# EAGLE schematic leer (EAGLE 6.5.0)
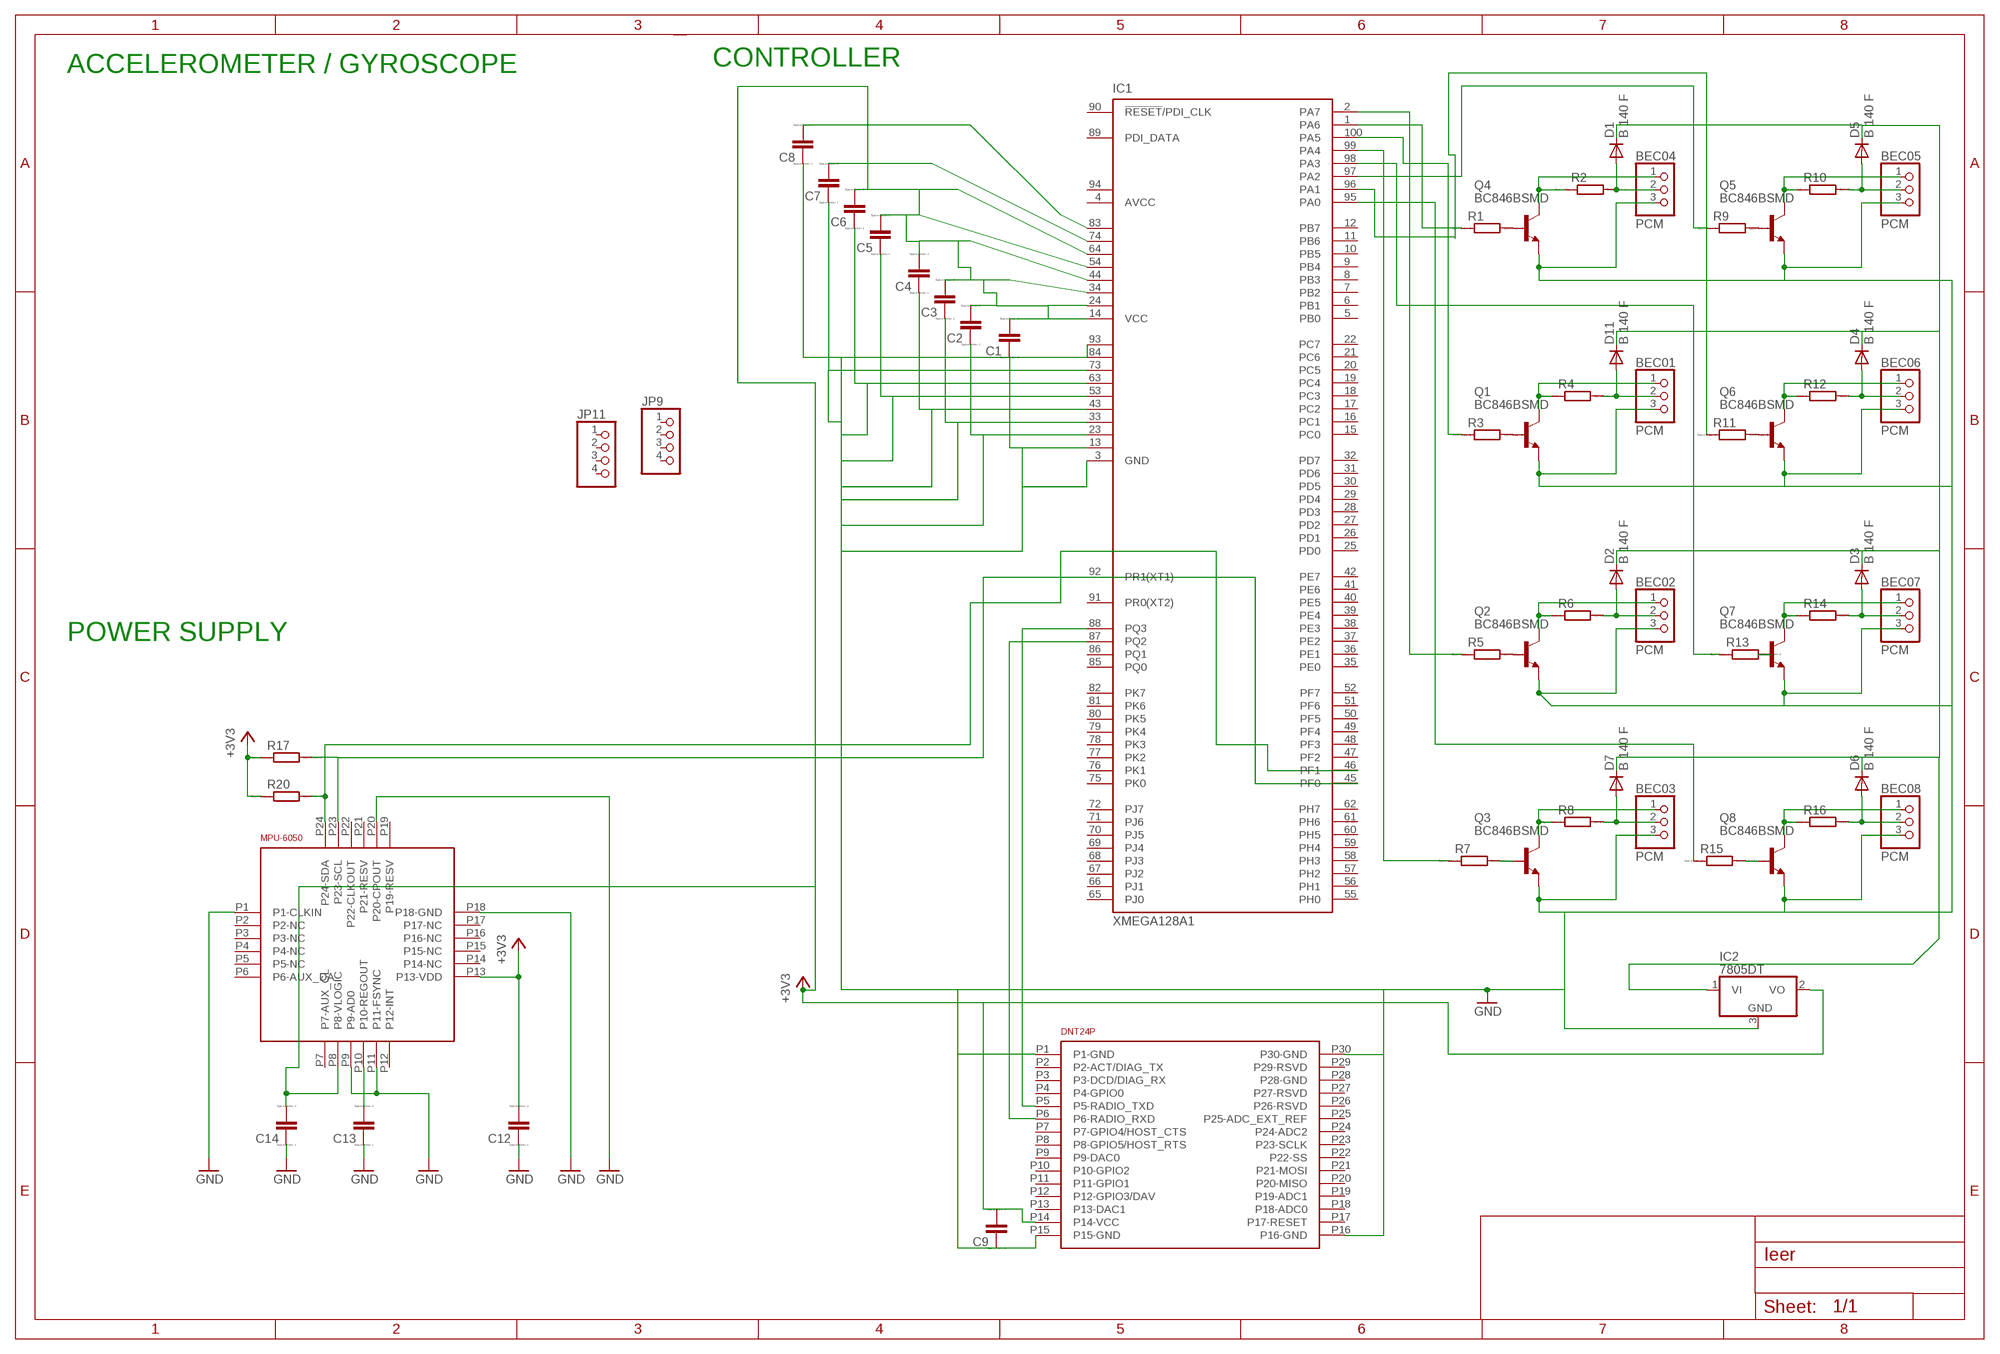
[diagram p0: schematic, sheet 1]

## Parts
BEC01  PCM  PINHD-1X3  [1X03]
BEC02  PCM  PINHD-1X3  [1X03]
BEC03  PCM  PINHD-1X3  [1X03]
BEC04  PCM  PINHD-1X3  [1X03]
BEC05  PCM  PINHD-1X3  [1X03]
BEC06  PCM  PINHD-1X3  [1X03]
BEC07  PCM  PINHD-1X3  [1X03]
BEC08  PCM  PINHD-1X3  [1X03]
C1  CC0603  [C0603]
C2  CC0603  [C0603]
C3  CC0603  [C0603]
C4  CC0603  [C0603]
C5  CC0603  [C0603]
C6  CC0603  [C0603]
C7  CC0603  [C0603]
C8  CC0603  [C0603]
C9  CC0603  [C0603]
C12  CC0603  [C0603]
C13  CC0603  [C0603]
C14  CC0603  [C0603]
D1  B 140 F  CGRM4001-G  [SOD-123_MINI-SMA]
D2  B 140 F  CGRM4001-G  [SOD-123_MINI-SMA]
D3  B 140 F  CGRM4001-G  [SOD-123_MINI-SMA]
D4  B 140 F  CGRM4001-G  [SOD-123_MINI-SMA]
D5  B 140 F  CGRM4001-G  [SOD-123_MINI-SMA]
D6  B 140 F  CGRM4001-G  [SOD-123_MINI-SMA]
D7  B 140 F  CGRM4001-G  [SOD-123_MINI-SMA]
D11  B 140 F  CGRM4001-G  [SOD-123_MINI-SMA]
IC1  XMEGA128A1  [TQFP100]
IC2  7805DT  [TO252]
JP9  PINHD-1X4  [1X04]
JP11  PINHD-1X4  [1X04]
Q1  BC846BSMD  [SOT23]
Q2  BC846BSMD  [SOT23]
Q3  BC846BSMD  [SOT23]
Q4  BC846BSMD  [SOT23]
Q5  BC846BSMD  [SOT23]
Q6  BC846BSMD  [SOT23]
Q7  BC846BSMD  [SOT23]
Q8  BC846BSMD  [SOT23]
R1  RR0603  [R0603]
R2  RR0603  [R0603]
R3  RR0603  [R0603]
R4  RR0603  [R0603]
R5  RR0603  [R0603]
R6  RR0603  [R0603]
R7  RR0603  [R0603]
R8  RR0603  [R0603]
R9  RR0603  [R0603]
R10  RR0603  [R0603]
R11  RR0603  [R0603]
R12  RR0603  [R0603]
R13  RR0603  [R0603]
R14  RR0603  [R0603]
R15  RR0603  [R0603]
R16  RR0603  [R0603]
R17  RR0603  [R0603]
R20  RR0603  [R0603]
U$1  DNT24P_RADIO_MODULE  [DNT24P_RADIO_MODULE]
U$3  MPU-6050_ACC_GYRO  [MPU-6050_ACC_GYRO]

## Nets
+3V3: C1.2 C2.2 C3.2 C4.2 C5.2 C6.2 C7.2 C8.2 C9.2 C12.2 C14.2 IC1.14(VCC) IC1.24(VCC1) IC1.34(VCC2) IC1.44(VCC3) IC1.54(VCC4) IC1.64(VCC5) IC1.74(VCC6) IC1.83(VCC7) IC2.2(VO) R17.1 R20.1 U$1.P14(P14-VCC) U$3.P8(P8-VLOGIC) U$3.P13(P13-VDD)
GND: BEC01.3 BEC02.3 BEC03.3 BEC04.3 BEC05.3 BEC06.3 BEC07.3 BEC08.3 C1.1 C2.1 C3.1 C4.1 C5.1 C6.1 C7.1 C8.1 C9.1 C12.1 C13.1 C14.1 IC1.3(GND) IC1.13(GND1) IC1.23(GND2) IC1.33(GND3) IC1.43(GND4) IC1.53(GND5) IC1.63(GND6) IC1.73(GND7) IC1.84(GND8) IC1.93(GND9) IC2.3(GND) Q1.2(E) Q2.2(E) Q3.2(E) Q4.2(E) Q5.2(E) Q6.2(E) Q7.2(E) Q8.2(E) U$1.P1(P1-GND) U$1.P15(P15-GND) U$1.P16(P16-GND) U$1.P30(P30-GND) U$3.P1(P1-CLKIN) U$3.P9(P9-AD0) U$3.P11(P11-FSYNC) U$3.P18(P18-GND)
N$1: Q4.1(B) R1.2
N$2: BEC01.1 Q1.3(C) R4.1
N$3: BEC01.2 D11.A R4.2
N$4: Q1.1(B) R3.2
N$5: BEC02.1 Q2.3(C) R6.1
N$6: BEC02.2 D2.A R6.2
N$7: Q2.1(B) R5.2
N$8: BEC03.1 Q3.3(C) R8.1
N$9: BEC03.2 D7.A R8.2
N$10: Q3.1(B) R7.2
N$11: BEC05.1 Q5.3(C) R10.1
N$12: BEC05.2 D5.A R10.2
N$13: Q5.1(B) R9.2
N$14: BEC04.1 Q4.3(C) R2.1
N$15: BEC04.2 D1.A R2.2
N$16: BEC06.1 Q6.3(C) R12.1
N$17: BEC06.2 D4.A R12.2
N$18: Q6.1(B) R11.2
N$19: BEC07.1 Q7.3(C) R14.1
N$20: BEC07.2 D3.A R14.2
N$21: Q7.1(B) R13.2
N$22: BEC08.1 Q8.3(C) R16.1
N$23: BEC08.2 D6.A R16.2
N$24: Q8.1(B) R15.2
N$25: IC1.1(PA6) R1.1
N$26: IC1.100(PA5) R3.1
N$27: IC1.97(PA2) R9.1
N$28: IC1.96(PA1) R11.1
N$29: IC1.2(PA7) R5.1
N$30: IC1.98(PA3) R13.1
N$31: IC1.99(PA4) R7.1
N$32: IC1.95(PA0) R15.1
N$33: IC1.88(PQ3) U$1.P5(P5-RADIO_TXD)
N$34: D1.C D2.C D3.C D4.C D5.C D6.C D7.C D11.C IC2.1(VI)
N$36: IC1.87(PQ2) U$1.P6(P6-RADIO_RXD)
N$37: C13.2 U$3.P10(P10-REGOUT)
N$38: U$3.P20(P20-CPOUT)
PF0: IC1.46(PF1) R20.2 U$3.P24(P24-SDA)
PF1: IC1.45(PF0) R17.2 U$3.P23(P23-SCL)
Unconnected: IC1.5(PB0) IC1.6(PB1) IC1.7(PB2) IC1.8(PB3) IC1.9(PB4) IC1.10(PB5) IC1.11(PB6) IC1.12(PB7) IC1.15(PC0) IC1.16(PC1) IC1.17(PC2) IC1.18(PC3) IC1.19(PC4) IC1.20(PC5) IC1.21(PC6) IC1.22(PC7) IC1.25(PD0) IC1.26(PD1) IC1.27(PD2) IC1.28(PD3) IC1.29(PD4) IC1.30(PD5) IC1.31(PD6) IC1.32(PD7) IC1.35(PE0) IC1.36(PE1) IC1.37(PE2) IC1.38(PE3) IC1.39(PE4) IC1.40(PE5) IC1.41(PE6) IC1.42(PE7) IC1.47(PF2) IC1.48(PF3) IC1.49(PF4) IC1.50(PF5) IC1.51(PF6) IC1.52(PF7) IC1.55(PH0) IC1.56(PH1) IC1.57(PH2) IC1.58(PH3) IC1.59(PH4) IC1.60(PH5) IC1.61(PH6) IC1.62(PH7) IC1.65(PJ0) IC1.66(PJ1) IC1.67(PJ2) IC1.68(PJ3) IC1.69(PJ4) IC1.70(PJ5) IC1.71(PJ6) IC1.72(PJ7) IC1.75(PK0) IC1.76(PK1) IC1.77(PK2) IC1.78(PK3) IC1.79(PK4) IC1.80(PK5) IC1.81(PK6) IC1.82(PK7) IC1.85(PQ0) IC1.86(PQ1) IC1.89(PDI_DATA) IC1.90(!RESET!/PDI_CLK) IC1.91(PR0(XT2)) IC1.92(PR1(XT1)) JP9.1 JP9.2 JP9.3 JP9.4 JP11.1 JP11.2 JP11.3 JP11.4 U$1.P2(P2-ACT/DIAG_TX) U$1.P3(P3-DCD/DIAG_RX) U$1.P4(P4-GPIO0) U$1.P7(P7-GPIO4/HOST_CTS) U$1.P8(P8-GPIO5/HOST_RTS) U$1.P9(P9-DAC0) U$1.P10(P10-GPIO2) U$1.P11(P11-GPIO1) U$1.P12(P12-GPIO3/DAV) U$1.P13(P13-DAC1) U$1.P17(P17-RESET) U$1.P18(P18-ADC0) U$1.P19(P19-ADC1) U$1.P20(P20-MISO) U$1.P21(P21-MOSI) U$1.P22(P22-SS) U$1.P23(P23-SCLK) U$1.P24(P24-ADC2) U$1.P25(P25-ADC_EXT_REF) U$1.P26(P26-RSVD) U$1.P27(P27-RSVD) U$1.P28(P28-GND) U$1.P29(P29-RSVD) U$3.P2(P2-NC) U$3.P3(P3-NC) U$3.P4(P4-NC) U$3.P5(P5-NC) U$3.P6(P6-AUX_DA) U$3.P7(P7-AUX_CL) U$3.P12(P12-INT) U$3.P14(P14-NC) U$3.P15(P15-NC) U$3.P16(P16-NC) U$3.P17(P17-NC) U$3.P19(P19-RESV) U$3.P21(P21-RESV) U$3.P22(P22-CLKOUT)

## Notes on the sheet
- ACCELEROMETER / GYROSCOPE | CONTROLLER
- POWER SUPPLY

## Power pins joined to a net without a drawn wire
AVCC: IC1.4(AVCC)
AVCC1: IC1.94(AVCC1)

## Library data of the parts
BEC01-BEC08 = pinhead:PINHD-1X3: PIN HEADER
C1-C9 C12-C14 = eagle-ltspice:C: CAPACITOR, European symbol; SPICEMODEL: NONE; SPICEPREFIX: C
D1-D7 D11 = diode:CGRM400*-G: Molded plasitc,JEDEC SOD-123/Mini SMA Source: Comchip CGRM4001-G.pdf
IC1 = atmel:XMEGA128A1: MICROCONTROLLER Features High-performance, Low-power 8/16-bit AVR XMEGA Microcontroller Non-Volatile Program and Data Memories - 64K - 384K Bytes of In-System Self-Programmable Flash - 4K - 8K Bytes Boot Section with Independent Lock Bits - 2 KB - 4 KB EEPROM - 4 KB - 32 KB Internal SRAM External Bus Interface for up to 16M bytes SRAM External Bus Interface for up to 128M bit SDRAM Peripheral Features - Four-channel DMA Controller with support for external requests - Eight-channel Event System - Eight 16-bit Timer/Counters Four Timer/Counters with 4 Output Compare or Input Capture channels Four Timer/Counters with 2 Output Compare or Input Capture channels High-Resolution Extension on all Timer/Counters Advanced Waveform Extension on two Timer/Counters - Eight USARTs IrDA modulation/demodulation for one USART - Four Two-Wire Interfaces with dual address match (I2C and SMBus compatible) - Four SPI (Serial Peripheral Interface) peripherals - AES and DES Crypto Engine - 16-bit Real Time Counter with separate Oscillator - Two Eight-channel, 12-bit, 2 Msps Analog to Digital Converters - Two Two-channel, 12-bit, 1 Msps Digital to Analog Converters - Four Analog Comparators with Window compare function - External Interrupts on all General Purpose I/O pins - Programmable Watchdog Timer with Separate On-chip Ultra Low Power Oscillator Special Microcontroller Features - Power-on Reset and Programmable Brown-out Detection - Internal and External Clock Options with PLL and Prescaler - Programmable Multi-level Interrupt Controller - Sleep Modes: Idle, Power-down, Standby, Power-save, Extended Standby - Advanced Programming, Test and Debugging Interfaces JTAG (IEEE 1149.1 Compliant) Interface for programming, test and debugging PDI (Program and Debug Interface) for programming and debugging I/O and Packages - 78 Programmable I/O Lines - 100 - lead TQFP - 100 - ball CBGA - 100 - ball VFBGA Operating Voltage - 1.6 - 3.6V Speed performance - 0 - 12 MHz @ 1.6 - 3.6V - 0 - 32 MHz @ 2.7 - 3.6V Drawn by Dipl.-Ing. (FH) Robert Siegler Created: 27.05.09; OC_FARNELL: unknown; OC_NEWARK: unknown
IC2 = linear:78*: Positive VOLTAGE REGULATOR Source: http://cache.national.com/ds/LM/LM78L05.pdf http://www.fairchildsemi.com/ds/LM/LM7805.pdf
JP9 JP11 = pinhead:PINHD-1X4: PIN HEADER
Q1-Q8 = transistor-npn:BC846*: NPN Transistor
R1-R17 R20 = eagle-ltspice:R: RESISTOR, European symbol; SPICEMODEL: NONE; SPICEPREFIX: R
U$1 = USER PARTS:DNT24P_RADIO_MODULE
U$3 = USER PARTS:MPU-6050_ACC_GYRO